# Altium project Basic FPGA.PrjPcb (part 2 of 2)

## Sheet Power.SchDoc
size A
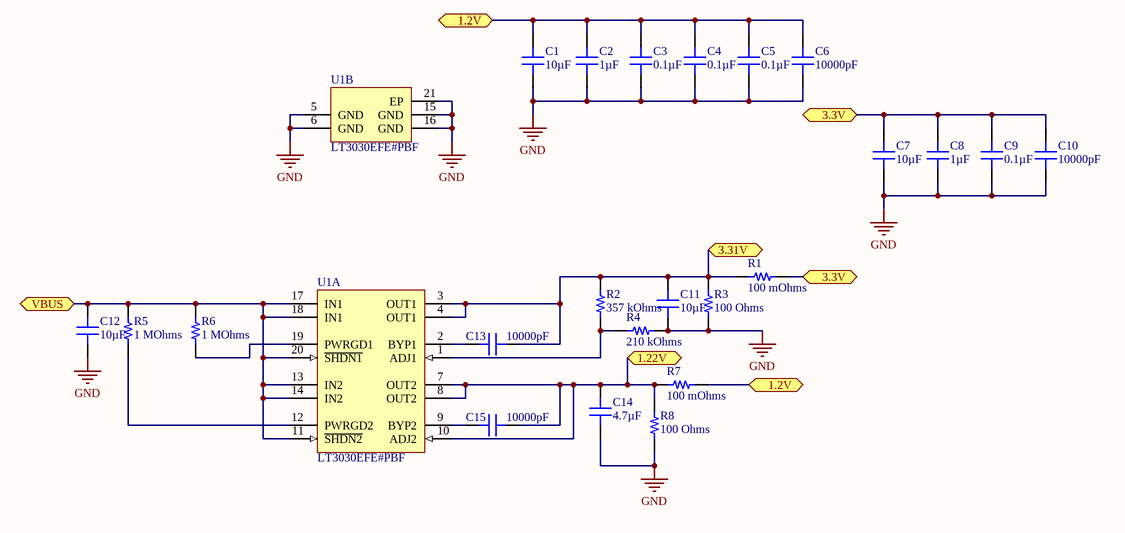
[diagram p5: Power.SchDoc]

### Parts
C1  10µF  [CAP 0805_2012]
C2  1µF  [CAP 0805_2012]
C3  0.1µF  [CAP 0805_2012]
C4  0.1µF  [CAP 0805_2012]
C5  0.1µF  [CAP 0805_2012]
C6  10000pF  [CAP 0805_2012]
C7  10µF  [CAP 0805_2012]
C8  1µF  [CAP 0805_2012]
C9  0.1µF  [CAP 0805_2012]
C10  10000pF  [CAP 0805_2012]
C11  10µF  [CAP 0805_2012]
C12  10µF  [CAP 0805_2012]
C13  10000pF  [CAP 0805_2012]
C14  4.7µF  [CAP 0805_2012]
C15  10000pF  [CAP 0805_2012]
R1  100 mOhms  [RES 0805_2012]
R2  357 kOhms  [RES 0805_2012]
R3  100 Ohms  [RES 0805_2012]
R4  210 kOhms  [RES 0805_2012]
R5  1 MOhms  [RES 0805_2012]
R6  1 MOhms  [RES 0805_2012]
R7  100 mOhms  [RES 0805_2012]
R8  100 Ohms  [RES 0805_2012]
U1  LT3030EFE#PBF  [LT-FE-20-EPV-CB_M]  (parts A,B of 2)

### Ports
1.2V (bidir), 1.22V (bidir), 3.3V (bidir), 3.31V (bidir), VBUS (bidir)

### Nets
GND: C1.1 C2.1 C3.1 C4.1 C5.1 C6.2 C7.1 C8.1 C9.1 C10.2 C11.1 C12.1 C14.1 R3.1 R4.2 R8.1 U1.5(GND) U1.6(GND) U1.15(GND) U1.16(GND) U1.21(EP)
Net*_4: C7.2 C8.2 C9.2 C10.1 R1.2 ; port 3.3V
NetC1_2: C1.2 C2.2 C3.2 C4.2 C5.2 C6.1 R7.2 ; port 1.2V
NetC11_2: C11.2 C13.1 R1.1 R2.2 R3.2 U1.3(OUT1) U1.4(OUT1) ; port 3.31V
NetC12_2: C12.2 R5.2 R6.2 U1.11(~{SHDN2}) U1.13(IN2) U1.14(IN2) U1.17(IN1) U1.18(IN1) U1.20(~{SHDN1}) ; port VBUS
NetC13_2: C13.2 U1.2(BYP1)
NetC14_2: C14.2 C15.1 R7.1 R8.2 U1.7(OUT2) U1.8(OUT2) U1.10(ADJ2) ; port 1.22V
NetC15_2: C15.2 U1.9(BYP2)
NetR2_1: R2.1 R4.1 U1.1(ADJ1)
NetR5_1: R5.1 U1.12(PWRGD2)
NetR6_1: R6.1 U1.19(PWRGD1)

### Library data of the parts
C1 C7 C11 C12 = CL21A106KOQNNNG: CAP CER 10UF 16V X5R 0805; Manufacturer: Samsung Electro-Mechanics; Tolerance: ±10%; Part Number: CL21A106KOQNNNG; Value: 10µF; Applications: General Purpose; Capacitance: 10µF; ComponentLink1Description: Datasheet; ComponentLink1URL: http://www.samsungsem.com/kr/support/product-search/mlcc/CL21A106KOQNNNG.jsp; ComponentLink2Description: DigiKey Link; ComponentLink2URL: http://digikey.com/product-detail/en/samsung-electro-mechanics/CL21A106KOQNNNG/1276-6455-1-ND/5958083; Device Package: 0805 (2012 Metric); LastUpdated: 9/2/2020 1:04:35 AM; Lifecycle Status: Active; Minimum Order: 1; Mounting Type: Surface Mount, MLCC; Operating Temperature: -55°C ~ 85°C; Package / Case: 0805 (2012 Metric); Packaging: TapeAndReel; PartId: 6236; Part Status: Active; Price: 0.02; Series: CL; Size / Dimension: 0.079" L x 0.049" W (2.00mm x 1.25mm); Supplier 1: DigiKey; Supplier Part Number 1: 1276-6455-1-ND; Temperature Coefficient: X5R; Thickness (Max): 0.055" (1.40mm); Voltage - Rated: 16V
C2 C8 = CL21B105KAFNNNE: CAP CER 1UF 25V X7R 0805; Manufacturer: Samsung Electro-Mechanics; Tolerance: ±10%; Part Number: CL21B105KAFNNNE; Value: 1µF; Applications: General Purpose; Capacitance: 1µF; ComponentLink1Description: Datasheet; ComponentLink1URL: http://www.samsungsem.com/kr/support/product-search/mlcc/CL21B105KAFNNNE.jsp; ComponentLink2Description: DigiKey Link; ComponentLink2URL: http://digikey.com/product-detail/en/samsung-electro-mechanics/CL21B105KAFNNNE/1276-1066-1-ND/3889152; Device Package: 0805 (2012 Metric); LastUpdated: 9/2/2020 1:04:35 AM; Lifecycle Status: Active; Minimum Order: 1; Mounting Type: Surface Mount, MLCC; Operating Temperature: -55°C ~ 125°C; Package / Case: 0805 (2012 Metric); Packaging: TapeAndReel; PartId: 6211; Part Status: Active; Price: 0.02; Series: CL; Size / Dimension: 0.079" L x 0.049" W (2.00mm x 1.25mm); Supplier 1: DigiKey; Supplier Part Number 1: 1276-1066-1-ND; Temperature Coefficient: X7R; Thickness (Max): 0.053" (1.35mm); Voltage - Rated: 25V
C3-C5 C9 = CL21B104KBCNNNC: CAP CER 0.1UF 50V X7R 0805; Manufacturer: Samsung Electro-Mechanics; Tolerance: ±10%; Part Number: CL21B104KBCNNNC; Value: 0.1µF; Applications: General Purpose; Capacitance: 0.1µF; ComponentLink1Description: Datasheet; ComponentLink1URL: http://www.samsungsem.com/kr/support/product-search/mlcc/CL21B104KBCNNNC.jsp; ComponentLink2Description: DigiKey Link; ComponentLink2URL: http://digikey.com/product-detail/en/samsung-electro-mechanics/CL21B104KBCNNNC/1276-1003-1-ND/3889089; Device Package: 0805 (2012 Metric); LastUpdated: 9/2/2020 1:04:35 AM; Lifecycle Status: Active; Minimum Order: 1; Mounting Type: Surface Mount, MLCC; Operating Temperature: -55°C ~ 125°C; Package / Case: 0805 (2012 Metric); Packaging: TapeAndReel; PartId: 6201; Part Status: Active; Price: 0.01; Series: CL; Size / Dimension: 0.079" L x 0.049" W (2.00mm x 1.25mm); Supplier 1: DigiKey; Supplier Part Number 1: 1276-1003-1-ND; Temperature Coefficient: X7R; Thickness (Max): 0.037" (0.95mm); Voltage - Rated: 50V
C6 C10 C13 C15 = CL21B103KBANNNC: CAP CER 10000PF 50V X7R 0805; Manufacturer: Samsung Electro-Mechanics; Tolerance: ±10%; Part Number: CL21B103KBANNNC; Value: 10000pF; Applications: General Purpose; Capacitance: 10000pF; ComponentLink1Description: Datasheet; ComponentLink1URL: http://www.samsungsem.com/kr/support/product-search/mlcc/CL21B103KBANNNC.jsp; ComponentLink2Description: DigiKey Link; ComponentLink2URL: http://digikey.com/product-detail/en/samsung-electro-mechanics/CL21B103KBANNNC/1276-1015-1-ND/3889101; Device Package: 0805 (2012 Metric); LastUpdated: 9/2/2020 1:04:35 AM; Lifecycle Status: Active; Minimum Order: 1; Mounting Type: Surface Mount, MLCC; Operating Temperature: -55°C ~ 125°C; Package / Case: 0805 (2012 Metric); Packaging: TapeAndReel; PartId: 6199; Part Status: Active; Price: 0.01; Series: CL; Size / Dimension: 0.079" L x 0.049" W (2.00mm x 1.25mm); Supplier 1: DigiKey; Supplier Part Number 1: 1276-1015-1-ND; Temperature Coefficient: X7R; Thickness (Max): 0.030" (0.75mm); Voltage - Rated: 50V
C14 = CL21A475KAQNNNE: CAP CER 4.7UF 25V X5R 0805; Manufacturer: Samsung Electro-Mechanics; Tolerance: ±10%; Part Number: CL21A475KAQNNNE; Value: 4.7µF; Applications: General Purpose; Capacitance: 4.7µF; ComponentLink1Description: Datasheet; ComponentLink1URL: http://www.samsungsem.com/kr/support/product-search/mlcc/CL21A475KAQNNNE.jsp; ComponentLink2Description: DigiKey Link; ComponentLink2URL: http://digikey.com/product-detail/en/samsung-electro-mechanics/CL21A475KAQNNNE/1276-1244-1-ND/3889330; Device Package: 0805 (2012 Metric); LastUpdated: 9/2/2020 1:04:19 AM; Lifecycle Status: Active; Minimum Order: 1; Mounting Type: Surface Mount, MLCC; Operating Temperature: -55°C ~ 85°C; Package / Case: 0805 (2012 Metric); Packaging: TapeAndReel; PartId: 14321; Part Status: Active; Price: 0.03; Series: CL; Size / Dimension: 0.079" L x 0.049" W (2.00mm x 1.25mm); Supplier 1: DigiKey; Supplier Part Number 1: 1276-1244-1-ND; Temperature Coefficient: X5R; Thickness (Max): 0.055" (1.40mm); Voltage - Rated: 25V
R1 R7 = RL1220S-R10-F: RES 0.1 OHM 1% 1/3W 0805; Manufacturer: Susumu; Power (Watts): 0.333W, 1/3W; Temperature Coefficient: 0/ +200ppm/°C; Part Number: RL1220S-R10-F; Value: 100 mOhms; ComponentLink1Description: Datasheet; ComponentLink1URL: http://www.susumu.co.jp/common/pdf/n_catalog_partition08_en.pdf; ComponentLink2Description: DigiKey Link; ComponentLink2URL: http://digikey.com/product-detail/en/susumu/RL1220S-R10-F/RL12S.10FCT-ND/433019; Composition: Thin Film; Device Package: 0805 (2012 Metric); Features: Current Sense; Height - Seated (Max): 0.020" (0.50mm); LastUpdated: 9/2/2020 1:15:23 AM; Lifecycle Status: Active; Minimum Order: 1; Number of Terminations: 2; Operating Temperature: -55°C ~ 125°C; Package / Case: 0805 (2012 Metric); Packaging: TapeAndReel; PartId: 28050; Part Status: Active; Price: 0.03; Resistance: 100 mOhms; Series: RL; Size / Dimension: 0.079" L x 0.049" W (2.00mm x 1.25mm); Supplier 1: DigiKey; Supplier Part Number 1: RL12S.10FCT-ND; Supplier Device Package: 0805; Tolerance: ±1%
R2 = ERJ-6ENF3573V: RES SMD 357K OHM 1% 1/8W 0805; Manufacturer: Panasonic Electronic Components; Power (Watts): 0.125W, 1/8W; Temperature Coefficient: ±100ppm/°C; Part Number: ERJ-6ENF3573V; Value: 357 kOhms; ComponentLink1Description: Datasheet; ComponentLink1URL: https://industrial.panasonic.com/cdbs/www-data/pdf/RDA0000/AOA0000C304.pdf; ComponentLink2Description: DigiKey Link; ComponentLink2URL: http://digikey.com/product-detail/en/panasonic-electronic-components/ERJ-6ENF3573V/P357KCCT-ND/119709; Composition: Thick Film; Device Package: 0805 (2012 Metric); Features: Automotive AEC-Q200; Height - Seated (Max): 0.028" (0.70mm); LastUpdated: 9/2/2020 1:14:35 AM; Lifecycle Status: Active; Minimum Order: 1; Number of Terminations: 2; Operating Temperature: -55°C ~ 155°C; Package / Case: 0805 (2012 Metric); Packaging: TapeAndReel; PartId: 47845; Part Status: Active; Price: 0.01; Ratings: AEC-Q200; Resistance: 357 kOhms; Series: ERJ; Size / Dimension: 0.079" L x 0.049" W (2.00mm x 1.25mm); Supplier 1: DigiKey; Supplier Part Number 1: P357KCCT-ND; Supplier Device Package: 0805; Tolerance: ±1%
R3 R8 = RNCP0805FTD100R: RES 100 OHM 1% 1/4W 0805; Manufacturer: Stackpole Electronics Inc; Power (Watts): 0.25W, 1/4W; Temperature Coefficient: ±100ppm/°C; Part Number: RNCP0805FTD100R; Value: 100 Ohms; ComponentLink1Description: Datasheet; ComponentLink1URL: https://www.seielect.com/catalog/sei-rncp.pdf; ComponentLink2Description: DigiKey Link; ComponentLink2URL: http://digikey.com/product-detail/en/stackpole-electronics-inc/RNCP0805FTD100R/RNCP0805FTD100RCT-ND/2240548; Composition: Thin Film; Device Package: 0805 (2012 Metric); Features: Anti-Sulfur, Moisture Resistant; Height - Seated (Max): 0.024" (0.60mm); LastUpdated: 9/2/2020 1:15:14 AM; Lifecycle Status: Active; Minimum Order: 1; Number of Terminations: 2; Operating Temperature: -55°C ~ 155°C; Package / Case: 0805 (2012 Metric); Packaging: TapeAndReel; PartId: 32189; Part Status: Active; Price: 0.01; Resistance: 100 Ohms; Series: RNCP; Size / Dimension: 0.079" L x 0.049" W (2.00mm x 1.25mm); Supplier 1: DigiKey; Supplier Part Number 1: RNCP0805FTD100RCT-ND; Supplier Device Package: 0805; Tolerance: ±1%
R4 = ERJ-6ENF2103V: RES SMD 210K OHM 1% 1/8W 0805; Manufacturer: Panasonic Electronic Components; Power (Watts): 0.125W, 1/8W; Temperature Coefficient: ±100ppm/°C; Part Number: ERJ-6ENF2103V; Value: 210 kOhms; ComponentLink1Description: Datasheet; ComponentLink1URL: https://industrial.panasonic.com/cdbs/www-data/pdf/RDA0000/AOA0000C304.pdf; ComponentLink2Description: DigiKey Link; ComponentLink2URL: http://digikey.com/product-detail/en/panasonic-electronic-components/ERJ-6ENF2103V/P210KCCT-ND/119643; Composition: Thick Film; Device Package: 0805 (2012 Metric); Features: Automotive AEC-Q200; Height - Seated (Max): 0.028" (0.70mm); LastUpdated: 9/2/2020 1:14:42 AM; Lifecycle Status: Active; Minimum Order: 1; Number of Terminations: 2; Operating Temperature: -55°C ~ 155°C; Package / Case: 0805 (2012 Metric); Packaging: TapeAndReel; PartId: 46340; Part Status: Active; Price: 0.01; Ratings: AEC-Q200; Resistance: 210 kOhms; Series: ERJ; Size / Dimension: 0.079" L x 0.049" W (2.00mm x 1.25mm); Supplier 1: DigiKey; Supplier Part Number 1: P210KCCT-ND; Supplier Device Package: 0805; Tolerance: ±1%
R5 R6 = RMCF0805FG1M00: RES 1M OHM 1% 1/8W 0805; Manufacturer: Stackpole Electronics Inc; Power (Watts): 0.125W, 1/8W; Temperature Coefficient: ±100ppm/°C; Part Number: RMCF0805FG1M00; Value: 1 MOhms; ComponentLink1Description: Datasheet; ComponentLink1URL: https://www.seielect.com/catalog/sei-rmcf_rmcp.pdf; ComponentLink2Description: DigiKey Link; ComponentLink2URL: http://digikey.com/product-detail/en/stackpole-electronics-inc/RMCF0805FG1M00/RMCF0805FG1M00CT-ND/4425150; Composition: Thick Film; Device Package: 0805 (2012 Metric); Features: Automotive AEC-Q200; Height - Seated (Max): 0.026" (0.65mm); LastUpdated: 9/2/2020 1:14:43 AM; Lifecycle Status: Active; Minimum Order: 1; Number of Terminations: 2; Operating Temperature: -55°C ~ 155°C; Package / Case: 0805 (2012 Metric); Packaging: CutTape; PartId: 46208; Part Status: Active; Price: 0.10; Ratings: AEC-Q200; Resistance: 1 MOhms; Series: RMCF; Size / Dimension: 0.079" L x 0.049" W (2.00mm x 1.25mm); Supplier 1: DigiKey; Supplier Part Number 1: RMCF0805FG1M00CT-ND; Supplier Device Package: 0805; Tolerance: ±1%
U1 = CMP-0476-00593-1: Dual 750 mA / 250 mA Low Dropout, Low Noise, Micropower Linear Regulator, 1.7 to 20 V Vin, Adjustable Vout, 20-pin SOP (FE-20-EPV-CB), -40 to 125 degC, Pb-Free; Manufacturer: Linear Technology; Noise(uV): 20; Vout Max(V): 19.5; Output Voltage: Adj; Number of Outputs: 2; Vout Min(V): 1.22; Iout(mA): 750; PSRR(dB): 60; Vin Min(V): 1.7; Isupply(mA): 15; Discrete Pass Element: no; Dropout Voltage(V): 0.3; Vin Max(V): 20; ComponentLink1URL: http://www.linear.com/; DatasheetVersion: Rev. A; PartNumber: LT3030EFE#PBF; PackageDescription: 20-Pin Plastic TSSOP, Body 6.5 x 4.4 mm, Pitch 0.65 mm; PackageReference: FE-20; ComponentLink2Description: Datasheet; PackageVersion: Rev. I, 05/2011; ComponentLink3Description: Package Specification; Mounting Technology: Surface Mount; ComponentLink3URL: http://cds.linear.com/docs/en/packaging/05081663__J_FE20(CB).pdf; ComponentLink2URL: http://cds.linear.com/docs/en/datasheet/3030fa.pdf; RoHS: TRUE; ComponentLink1Description: Manufacturer URL; Shutdown Current(uA): 0.3

## Nets that join several sheets
GND: FPGA (20 pins), Programmer (21 pins), Connectors (J1.5), Power (21 pins)
Net*_4: FPGA (27 pins), Programmer (20 pins), Power (5 pins)
NetC1_2: FPGA (7 pins), Power (7 pins)
NetC12_2: Connectors (J1.1), Power (9 pins)
NetD2_1: FPGA (U4.73), 10x15 Matrix (16 pins), Connectors (P2.1)
NetD17_1: FPGA (U4.74), 10x15 Matrix (16 pins), Connectors (P2.2)
NetD32_1: FPGA (U4.75), 10x15 Matrix (16 pins), Connectors (P2.3)
NetD47_1: FPGA (U4.76), 10x15 Matrix (16 pins), Connectors (P2.4)
NetD62_1: FPGA (U4.78), 10x15 Matrix (16 pins), Connectors (P2.5)
NetD77_1: FPGA (U4.79), 10x15 Matrix (16 pins), Connectors (P2.6)
NetD92_1: FPGA (U4.80), 10x15 Matrix (16 pins), Connectors (P2.7)
NetD107_1: FPGA (U4.81), 10x15 Matrix (16 pins), Connectors (P2.8)
NetD122_1: FPGA (U4.87), 10x15 Matrix (16 pins), Connectors (P2.9)
NetD137_1: FPGA (U4.88), 10x15 Matrix (16 pins), Connectors (P2.10)
NetJ1_2: Programmer (U2.7), Connectors (J1.2)
NetJ1_3: Programmer (U2.8), Connectors (J1.3)
NetP1_1: FPGA (U4.112), Connectors (P1.1)
NetP1_2: FPGA (U4.113), Connectors (P1.2)
NetP1_3: FPGA (U4.114), Connectors (P1.3)
NetP1_4: FPGA (U4.115), Connectors (P1.4)
NetP1_5: FPGA (U4.116), Connectors (P1.5)
NetP1_6: FPGA (U4.117), Connectors (P1.6)
NetP1_7: FPGA (U4.118), Connectors (P1.7)
NetP1_8: FPGA (U4.119), Connectors (P1.8)
NetP1_9: FPGA (U4.120), Connectors (P1.9)
NetP1_10: FPGA (U4.121), Connectors (P1.10)
NetP1_11: FPGA (U4.122), Connectors (P1.11)
NetP1_12: FPGA (U4.128), Connectors (P1.12)
NetP1_13: FPGA (U4.129), Connectors (P1.13)
NetP3_1: FPGA (U4.37), Connectors (P3.1)
NetP3_2: FPGA (U4.38), Connectors (P3.2)
NetP3_3: FPGA (U4.39), Connectors (P3.3)
NetP3_4: FPGA (U4.41), Connectors (P3.4)
NetP3_5: FPGA (U4.42), Connectors (P3.5)
NetP3_6: FPGA (U4.43), Connectors (P3.6)
NetP3_7: FPGA (U4.44), Connectors (P3.7)
NetP3_8: FPGA (U4.45), Connectors (P3.8)
NetP3_9: FPGA (U4.47), Connectors (P3.9)
NetP3_10: FPGA (U4.48), Connectors (P3.10)
NetP4_1: FPGA (U4.10), Connectors (P4.1)
NetP4_2: FPGA (U4.11), Connectors (P4.2)
NetP4_3: FPGA (U4.12), Connectors (P4.3)
NetP4_4: FPGA (U4.19), Connectors (P4.4)
NetP4_5: FPGA (U4.20), Connectors (P4.5)
NetP4_6: FPGA (U4.22), Connectors (P4.6)
NetP4_7: FPGA (U4.23), Connectors (P4.7)
NetP4_8: FPGA (U4.24), Connectors (P4.8)
NetP4_9: FPGA (U4.25), Connectors (P4.9)
NetP4_10: FPGA (U4.26), Connectors (P4.10)
NetP4_11: FPGA (U4.28), Connectors (P4.11)
NetP4_12: FPGA (U4.29), Connectors (P4.12)
NetP4_13: FPGA (U4.31), Connectors (P4.13)
NetP4_14: FPGA (U4.32), Connectors (P4.14)
NetP4_15: FPGA (U4.33), Connectors (P4.15)
NetP4_16: FPGA (U4.34), Connectors (P4.16)
NetP5_1: FPGA (U4.134), Connectors (P5.1)
NetP5_2: FPGA (U4.135), Connectors (P5.2)
NetP5_3: FPGA (U4.136), Connectors (P5.3)
NetP5_4: FPGA (U4.137), Connectors (P5.4)
NetP5_5: FPGA (U4.138), Connectors (P5.5)
NetP5_6: FPGA (U4.139), Connectors (P5.6)
NetP5_7: FPGA (U4.141), Connectors (P5.7)
NetP5_8: FPGA (U4.142), Connectors (P5.8)
NetP5_9: FPGA (U4.143), Connectors (P5.9)
NetP5_10: FPGA (U4.144), Connectors (P5.10)
NetP6_1: FPGA (U4.90), 10x15 Matrix (P8.15 R35.2), Connectors (P6.1)
NetP6_2: FPGA (U4.91), 10x15 Matrix (P8.14 R36.2), Connectors (P6.2)
NetP6_3: FPGA (U4.93), 10x15 Matrix (P8.13 R37.2), Connectors (P6.3)
NetP6_4: FPGA (U4.94), 10x15 Matrix (P8.12 R38.2), Connectors (P6.4)
NetP6_5: FPGA (U4.95), 10x15 Matrix (P8.11 R39.2), Connectors (P6.5)
NetP6_6: FPGA (U4.96), 10x15 Matrix (P8.10 R40.2), Connectors (P6.6)
NetP6_7: FPGA (U4.97), 10x15 Matrix (P8.9 R41.2), Connectors (P6.7)
NetP6_8: FPGA (U4.98), 10x15 Matrix (P8.8 R42.2), Connectors (P6.8)
NetP6_9: FPGA (U4.99), 10x15 Matrix (P8.7 R43.2), Connectors (P6.9)
NetP6_10: FPGA (U4.101), 10x15 Matrix (P8.6 R44.2), Connectors (P6.10)
NetP6_11: FPGA (U4.102), 10x15 Matrix (P8.5 R45.2), Connectors (P6.11)
NetP6_12: FPGA (U4.104), 10x15 Matrix (P8.4 R46.2), Connectors (P6.12)
NetP6_13: FPGA (U4.105), 10x15 Matrix (P8.3 R47.2), Connectors (P6.13)
NetP6_14: FPGA (U4.106), 10x15 Matrix (P8.2 R48.2), Connectors (P6.14)
NetP6_15: FPGA (U4.107), 10x15 Matrix (P8.1 R49.2), Connectors (P6.15)
NetP7_1: FPGA (U4.49), Connectors (P7.1)
NetP7_2: FPGA (U4.50), Connectors (P7.2)
NetP7_3: FPGA (U4.52), Connectors (P7.3)
NetP7_4: FPGA (U4.56), Connectors (P7.4)
NetP7_5: FPGA (U4.58), Connectors (P7.5)
NetP7_6: FPGA (U4.60), Connectors (P7.6)
NetP7_7: FPGA (U4.61), Connectors (P7.7)
NetP7_8: FPGA (U4.62), Connectors (P7.8)
NetP7_9: FPGA (U4.63), Connectors (P7.9)
NetP7_10: FPGA (U4.64), Connectors (P7.10)
NetR9_1: FPGA (R31.1 U4.70 U5.6), Programmer (R9.1)
NetR10_1: FPGA (U4.67 U5.5), Programmer (R10.1)
NetR11_1: FPGA (U4.68 U5.2), Programmer (R11.1)
NetR12_1: FPGA (R32.2 U4.71 U5.1), Programmer (R12.1)
NetR13_1: FPGA (R29.1 U4.65), Programmer (R13.1)
NetR14_1: FPGA (R30.1 U4.66), Programmer (R14.1)
NetR20_1: FPGA (U4.9), Programmer (R20.1)
NetR21_1: FPGA (U4.8), Programmer (R21.1)
NetR22_1: FPGA (U4.7), Programmer (R22.1)
NetR23_1: FPGA (U4.4), Programmer (R23.1)
NetR24_1: FPGA (U4.3), Programmer (R24.1)
NetR25_1: FPGA (U4.2), Programmer (R25.1)
NetR26_1: FPGA (U4.1), Programmer (R26.1)
NetR28_1: FPGA (U4.21), Programmer (R28.1)